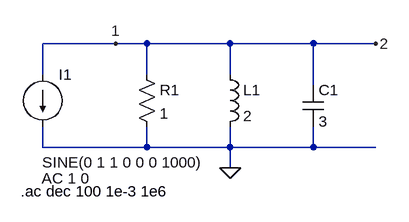
[diagram p0: schematic rlc_paralelo.asc]
rlc_paralelo.asc, the LTspice schematic file:
Version 4
SHEET 1 880 680
WIRE 96 64 -16 64
WIRE 144 64 96 64
WIRE 272 64 144 64
WIRE 400 64 272 64
WIRE 496 64 400 64
WIRE -16 112 -16 64
WIRE 144 112 144 64
WIRE 272 112 272 64
WIRE 400 128 400 64
WIRE -16 224 -16 192
WIRE 144 224 144 192
WIRE 144 224 -16 224
WIRE 272 224 272 192
WIRE 272 224 144 224
WIRE 400 224 400 192
WIRE 400 224 272 224
WIRE 496 224 400 224
WIRE 272 256 272 224
FLAG 272 256 0
FLAG 96 64 1
FLAG 496 64 2
SYMBOL res 128 96 R0
SYMATTR InstName R1
SYMATTR Value 1
SYMBOL ind 256 96 R0
SYMATTR InstName L1
SYMATTR Value 2
SYMBOL cap 384 128 R0
SYMATTR InstName C1
SYMATTR Value 3
SYMBOL current -16 112 R0
WINDOW 3 -1 135 Left 2
WINDOW 123 -2 160 Left 2
WINDOW 39 0 0 Left 0
SYMATTR InstName I1
SYMATTR Value SINE(0 1 1 0 0 0 1000)
SYMATTR Value2 AC 1 0
TEXT -50 292 Left 2 !.ac dec 100 1e-3 1e6

The netlist it stands for:
* rlc_paralelo.asc
R1 2 0 1
L1 2 0 2
C1 2 0 3
I1 2 0 SINE(0 1 1 0 0 0 1000) AC 1 0
.ac dec 100 1e-3 1e6
.backanno
.end